# Altium schematic sheet Led_Green_Direct.SchDoc
size A4; SheetNumber: 4; SheetTotal: 29
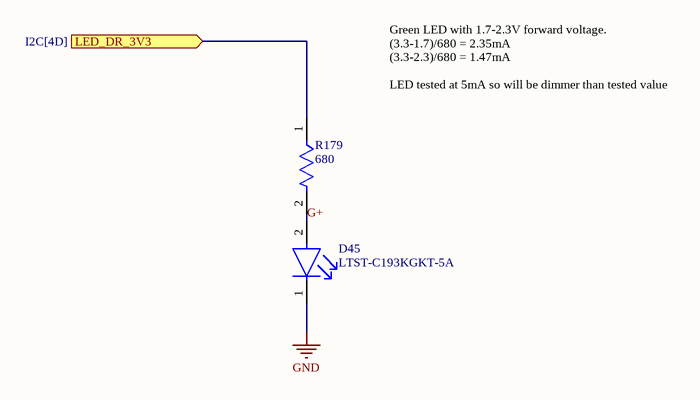
[diagram p0: Led_Green_Direct.SchDoc]

## Parts
D45  LTST-C193KGKT-5A  [FP-LTST-C193KGKT-5A-MFG]
R179  value 680  [FP-CRCW0603-e3-IPC_C]  (hidden comment: CRCW0603680RJNEA)

## Ports
LED_DR_3V3 (in, see I2C[4D])

## Nets
GND: D45.1(C)
G+: D45.2(A) R179.2
LED_DR_3V3: R179.1 ; port LED_DR_3V3

## Notes on the sheet
- Green LED with 1.7-2.3V forward voltage.
  (3.3-1.7)/680 = 2.35mA
  (3.3-2.3)/680 = 1.47mA
  LED tested at 5mA so will be dimmer than tested value

## Library data of the parts
D45 = CMP-007-00038-1: LED yellow green 0603 wavelength 567.5~576.5nm light intensity 4.5~28mcd Front Mounting; Luminous Intensity: 16.25mcd; Viewing Angle: 130°; Number of Circuits: 1; Power Dissipation: 50mW; Peak Wavelength: 574nm; Illumination Color: Green, Yellow; Lens Color: Clear, Colorless; Lens Style: Clear, Colorless, Diffused, Rectangular; Forward Voltage: 1.9V; Power Rating: 75mW; Reverse Voltage: 5V; Wavelength: 571nm; Shape: Rectangular; Lens Transparency: Clear; Test Current: 5mA; Forward Current: 30mA; Width: 800µm; Manufacturer Package Identifier: LTST-C193KGKT-5A; Dominant Wavelength: 576.5nm; Export Control Classification Number (ECCN) Code: EAR99; Color: Green; Lead Free: Lead Free; Introduction Date: 2007-03-15; RoHS: Compliant; Number of Elements: 1; Height: 350µm; Schedule B: 8541402000, 8541402000; Country of Origin: Mainland China, Thailand; Case Code (Imperial): 0603; Length: 1.6mm; Lifecycle Status: Production; China RoHS: Compliant; Min Operating Temperature: -55°C; Terminal Pitch: 1.5mm; Number of LEDs: 1; Number of Terminals: 2; Pins: 2; Case Code (Metric): 1608; Max Operating Temperature: 85°C; Harmonized Tariff Schedule (HTS) Code: 8541.40.20.00; Depth: 800µm; Mounting Technology: Surface Mount; Case/Package: 0603; REACH SVHC: Yes; Radiation Hardening: No
R179 = CMP-009-00300-1: Fixed Resistor, Metal Glaze/Thick Film, 0.1W, 680ohm, 75V, 5% +/-Tol, Surface Mount, 0603; Power Rating: 100mW; Temperature Coefficient: 200ppm/°C; Case/Package: 0603; Voltage Rating (DC): 75V; Lifecycle Status: Production; Depth: 850µm; Introduction Date: 2005-02-16; Number of Terminations: 2; Composition: Thick Film; Export Control Classification Number (ECCN) Code: EAR99; RoHS: Compliant; Packaging: Cut Tape; Max Power Dissipation: 100mW; Max Operating Temperature: 155°C; Harmonized Tariff Schedule (HTS) Code: 8533.21.00.30; Voltage Rating: 75V; China RoHS: Non-Compliant; Width: 850µm; Height: 450µm; Schedule B: 8533210045, 8533210045; Mounting Technology: Surface Mount; Pins: 2; Radiation Hardening: No; Features: Automotive AEC-Q200; Min Operating Temperature: -55°C; Lead Free: Lead Free; Working Voltage: 75V; Military Standard: Not; Tolerance: 5%; Case Code (Imperial): 0603; Number of Terminals: 2; Weight: 2.012816mg; REACH SVHC: Yes; Length: 1.55mm; Ratings: AEC-Q200; Contact Plating: Tin; Termination: SMD/SMT; Country of Origin: Israel, Taiwan